# Altium schematic sheet Temp Sensor Board MAX31725.SchDoc: Temp Sensor MAX31725
size Tabloid; SheetNumber: 2; SheetTotal: 2; PageSetup: Record=PageOptions|CenterHorizontal=True|CenterVertical=True|PrintScale=0.96|XCorrection=1.00|YCorrection=1.00|PrintKind=0|BorderSize=5000000|LeftOffset=0|BottomOffset=0|Orientation=2|PaperLength=1000|PaperWidth=1000|Scale=100|PaperSource=7|PrintQuality=-4|MediaType=1|DitherType=10|PaperKind=11" x 17"|PrintScaleMode=1; Reminder: PRELIMINARY
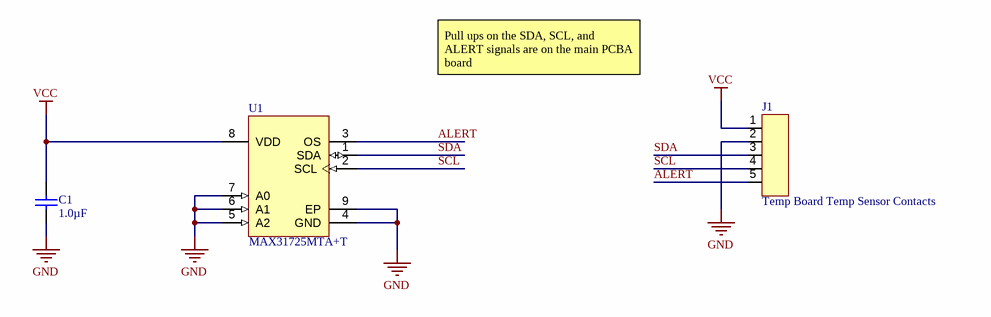
[diagram p0: Temp Sensor Board MAX31725.SchDoc]

## Parts
C1  1.0µF  [CAPC0402(1005)60_N]
J1  Temp Board Temp Sensor Contacts  [Temp Board Temp Sensor Contacts-Footprint-1]  (no BOM)
U1  MAX31725MTA+T  [MAXM-T833+2_V]

## Nets
GND: C1.1 J1.2 U1.4(GND) U1.5(A2) U1.6(A1) U1.7(A0) U1.9(EP)
VCC: C1.2 J1.1 U1.8(VDD)
ALERT: J1.5 U1.3(OS)
SCL: J1.4 U1.2(SCL)
SDA: J1.3 U1.1(SDA)

## Notes on the sheet
- Pull ups on the SDA, SCL, and ALERT signals are on the main PCBA board
- TITLE
- DOC NUMBER
- VARIANT
- REV
- 10875 dover st, suite 500
  westminster, co, 80021, usa
  syncroness.com
- FILE
- ENGINEER
- SHEET
- DATE
- OF
- THIS DOCUMENT IS CONFIDENTIAL AND THE PROPERTY OF SYNCRONESS, INC. AND ITS SUBSIDARIES. IT SHALL NOT BE REPRODUCED IN ANY MANNER NOR USED FOR ANY PURPOSE WHATSOEVER EXCEPT AS SPECIFIED IN WRITING BY SYNCRONESS, INC.

## Library data of the parts
C1 = CMP-13694-A.6: CAP CER 1UF 10V 10% X5R 0402; Manufacturer: Yageo; Manufacturer Part Number: CC0402KRX5R6BB105; Manufacturer 2: Samsung Electro-Mechanics; Manufacturer 3: AVX Corporation; Manufacturer Part Number 2: CL05A105KP5NNNC; Manufacturer Part Number 3: 0402ZD105KAT2A; Operating Temperature: -55°C ~ 85°C; Supplier Part Number 1: 311-1439-1-ND; Supplier Part Number 2: 1276-1076-1-ND; Supplier Part Number 3: 478-4596-1-ND; Temperature Coefficient: X5R; Tolerance: ±10%; Capacitance: 1.0µF; Voltage - Rated: 10V; Supplier 2: Digi-Key; Supplier 3: Digi-Key; Supplier 1: Digi-Key; Datasheet: http://www.samsungsem.com/kr/support/product-search/mlcc/__icsFiles/afieldfile/2019/05/10/19-CL05A105KP5NNNC.pdf
J1 = CMP-23773-A.2: Temp Sensor Contact Pads
U1 = CMP-23703-A.4: SENSOR DIGITAL -55C-150C 8TDFN; Manufacturer: Maxim Integrated; Interface: I2C,SMBus,2-Wire; Max Supply Voltage (DC): 3.7V; Min Supply Voltage (DC): 2.5V; Resolution: 16b; Output Type: Digital,I2C; Number of Pins: 8; Contact Plating: Tin; Min Operating Temperature: -55°C; Max Operating Temperature: 150°C; Package Quantity: 2500; Packaging: Tape and Reel; Operating Supply Voltage: 3.7V; Datasheet: https://datasheets.maximintegrated.com/en/ds/MAX31725.pdf; Manufacturer Part Number: MAX31725MTA+T; Supplier: Digi-Key; Supplier Part Number: MAX31725MTA+TCT-ND